# Altium schematic sheet Oplader.SchDoc
size A4; SheetNumber: 2; SheetTotal: 2
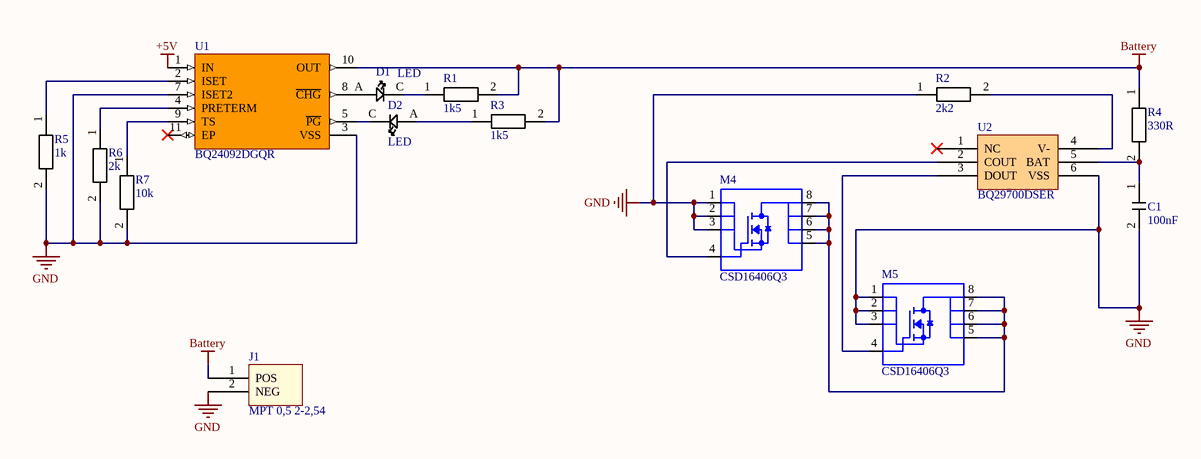
[diagram p0: Oplader.SchDoc]

## Parts
C1  100nF  [0603]
D1  LED  [LED]
D2  LED  [LED]
J1  MPT 0,5 2-2,54  [MPT 0,5 2-2,54]
M4  CSD16406Q3  [CSD16406Q3]
M5  CSD16406Q3  [CSD16406Q3]
R1  1k5  [0603]
R2  2k2  [0603]
R3  1k5  [0603]
R4  330R  [0603]
R5  1k  [0603]
R6  2k  [0603]
R7  10k  [0603]
U1  BQ24092DGQR  [BQ24092DGQR]
U2  BQ29700DSER  [BQ29700DSER]

## Nets
+5V: U1.1(IN)
Battery: J1.1(POS) R1.2(G) R3.2(G) R4.1 U1.10(OUT)
GND: C1.2(G) J1.2(NEG) M4.1(S_1) M4.2(S_2) M4.3(S_3) M5.1(S_1) M5.2(S_2) M5.3(S_3) R2.1 R5.2(G) R6.2(G) R7.2(G) U1.3(VSS) U1.7(ISET2) U2.6(VSS)
NetC1_1: C1.1(G) R4.2(G) U2.5(BAT)
NetD1_A: D1.A U1.8(~{CHG})
NetD1_C: D1.C R1.1
NetD2_A: D2.A R3.1
NetD2_C: D2.C U1.5(~{PG})
NetM4_4: M4.4(G) U2.2(COUT)
NetM4_5: M4.5(D_5) M4.6(D_6) M4.7(D_7) M4.8(D_8) M5.5(D_5) M5.6(D_6) M5.7(D_7) M5.8(D_8)
NetM5_4: M5.4(G) U2.3(DOUT)
NetR2_2: R2.2(G) U2.4(V-)
NetR5_1: R5.1 U1.2(ISET)
NetR6_1: R6.1 U1.4(PRETERM)
NetR7_1: R7.1 U1.9(TS)

Not connected (* = marked no-connect by the designer): U1 11(EP)*; U2 1(NC)*

## Library data of the parts
C1 = Condensator
R1-R7 = weerstand